# Altium schematic sheet Sheet1.SchDoc
size A4; SheetNumber: 1; SheetTotal: 1
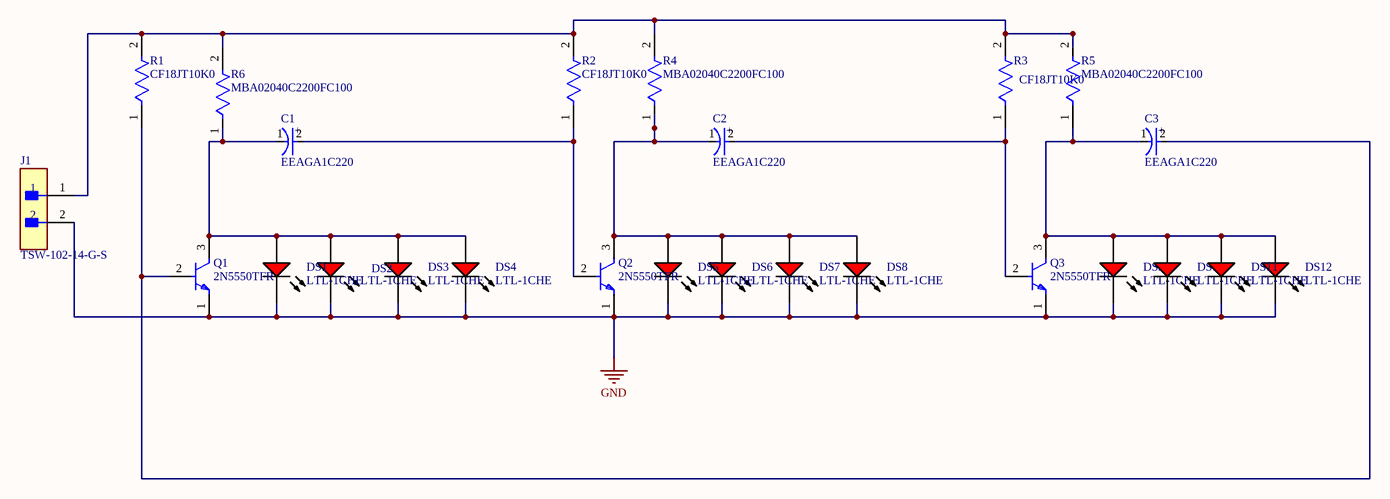
[diagram p0: Sheet1.SchDoc]

## Parts
C1  EEAGA1C220  [FP-RAD-TH-D_5_0_5-L_7_1-F-MFG]
C2  EEAGA1C220  [FP-RAD-TH-D_5_0_5-L_7_1-F-MFG]
C3  EEAGA1C220  [FP-RAD-TH-D_5_0_5-L_7_1-F-MFG]
DS1  LTL-1CHE  [INDPR60-254-520X380X650]
DS2  LTL-1CHE  [INDPR60-254-520X380X650]
DS3  LTL-1CHE  [INDPR60-254-520X380X650]
DS4  LTL-1CHE  [INDPR60-254-520X380X650]
DS5  LTL-1CHE  [INDPR60-254-520X380X650]
DS6  LTL-1CHE  [INDPR60-254-520X380X650]
DS7  LTL-1CHE  [INDPR60-254-520X380X650]
DS8  LTL-1CHE  [INDPR60-254-520X380X650]
DS9  LTL-1CHE  [INDPR60-254-520X380X650]
DS10  LTL-1CHE  [INDPR60-254-520X380X650]
DS11  LTL-1CHE  [INDPR60-254-520X380X650]
DS12  LTL-1CHE  [INDPR60-254-520X380X650]
J1  TSW-102-14-G-S  [FP-TSW-102-14-G-S-MFG]
Q1  2N5550TFR  [FP-135AR-MFG]
Q2  2N5550TFR  [FP-135AR-MFG]
Q3  2N5550TFR  [FP-135AR-MFG]
R1  CF18JT10K0  [FP-CF18-MFG]
R2  CF18JT10K0  [FP-CF18-MFG]
R3  CF18JT10K0  [FP-CF18-MFG]
R4  MBA02040C2200FC100  [FP-MBA0204-MFG]
R5  MBA02040C2200FC100  [FP-MBA0204-MFG]
R6  MBA02040C2200FC100  [FP-MBA0204-MFG]

## Nets
GND: DS1.2(K) DS2.2(K) DS3.2(K) DS4.2(K) DS5.2(K) DS6.2(K) DS7.2(K) DS8.2(K) DS9.2(K) DS10.2(K) DS11.2(K) DS12.2(K) J1.2 Q1.1(E) Q2.1(E) Q3.1(E)
NetC1_1: C1.1(C) DS1.1(A) DS2.1(A) DS3.1(A) DS4.1(A) Q1.3(C) R6.1
NetC1_2: C1.2(A) Q2.2(B) R2.1
NetC2_1: C2.1(C) DS5.1(A) DS6.1(A) DS7.1(A) DS8.1(A) Q2.3(C) R4.1
NetC2_2: C2.2(A) Q3.2(B) R3.1
NetC3_1: C3.1(C) DS9.1(A) DS10.1(A) DS11.1(A) DS12.1(A) Q3.3(C) R5.1
NetC3_2: C3.2(A) Q1.2(B) R1.1
NetJ1_1: J1.1 R1.2 R2.2 R3.2 R4.2 R5.2 R6.2

## Notes on the sheet
- (in symbol CMP-05427-000251-1) +

## Library data of the parts
C1-C3 = CMP-05427-000251-1: Aluminum Electrolytic Capacitors (Radial Lead Type) 22uF ±20% 16V; Ripple Current: 50mA; Leakage Current: 3.5uA; Polarity: Polar; Life (Hours): 1000Hour; Lead Diameter: 0.45mm; Package Quantity: 200; Termination: Radial; Series: GA; Diameter: 5mm; Lead Pitch: 2mm; Height - Seated (Max): 0.276inch; Voltage Rating (DC): 16V; Case/Package: Radial; Packaging: Bulk; Capacitance: 22uF; Mount: Through Hole; REACH SVHC: No SVHC; Radiation Hardening: No; Min Operating Temperature: -55°C; Ripple Current (AC): 50mA; Length: 7mm; Max Operating Temperature: 105°C; Construction: RADIAL; RoHS Compliant: Yes; Voltage: 16V; Voltage Rating: 16V; Height: 7mm; Tolerance: 20%
DS1-DS12 = CMP-1674-00005-1: Radial LED, 12.6 mcd, 20 mA, 2 V, -55 to 100 degC, 2-Pin THD, RoHS, Bulk; Shielding: Unshielded; Resistance: 0.045 Ohm; Current Rating: 3.6 A; Tolerance: 20%; PackageReference: LTL-1CHE; PackageDescription: 2-Pin Through Hole Device, Dia 3.8 mm, Pitch 2.54 mm; Case\Package: Radial; Length: 0.97 inch; Width: 0.62 inch; Height: 1.1 inch; Radiation Hardening: No; Lead Pitch: 11.44 mm; ComponentLink1URL: http://www.us.liteon.com/; ComponentLink1Description: Manufacturer URL; RoHSCompliant: true; Packaging: Tray; Mount: Through Hole; Min Operating Temperature: -40 degC; Max Operating Temperature: 130 degC; ComponentLink2URL: https://datasheet.ciiva.com/15117/getdatasheetpartid-187746-15117985.pdf; Package Quantity: 55; ComponentLink2Description: Datasheet; DatasheetVersion: Dec-03
J1 = CMP-02766-001740-1: CONN HEADER VERT 2POS 2.54MM; Number of Positions: 2; Max Current Rating: 7.6A; Gender: Male; Max Voltage Rating (AC): 550V; Contact Mating Length: 0.32inch; REACH SVHC: No SVHC; Width: 2.54mm; Insulation Material: PBT; Contact Shape: Square; Contact Plating: Gold; Min Operating Temperature: -55°C; Contact Material: Bronze; Color: Black; Number of Contacts: 2; Housing Material: Polyester; Orientation: Straight; Flammability Rating: UL94 V-0; Max Operating Temperature: 125°C; Contact Type: Male Pin; Radiation Hardening: No; Termination: Solder; RoHS Compliant: Yes; Lead Free: Lead Free; Fastening Type: Pull; Pitch: 2.54mm; Number of Rows: 1; Series: TSW; Insulation Color: Black; Package Quantity: 1; Connector Type: Header; Length: 5.08mm; Contact Finish - Mating: GOLD; Mount: Through Hole; Housing Color: Black; Depth: 2.54mm; Packaging: Bulk
Q1-Q3 = CMP-00278-84408887-1: 2N5550TFR Transistor, bjt, npn, 140V V(Br)Ceo, 600Ma I(C), to-92 Rohs Compliant: Yes; Manufacturer Lifecycle Status: ACTIVE; Gain Bandwidth Product: 300MHz; Max Power Dissipation: 625mW; hFE Min: 60; Emitter Base Voltage (VEBO): 6V; Max Junction Temperature (Tj): 150°C; Number of Elements: 1; Collector Emitter Saturation Voltage: 250mV; Element Configuration: Single; Collector Base Voltage (VCBO): 160V; Min Operating Temperature: -55°C; Case/Package: TO-92-3; Weight: 240mg; Max Frequency: 300MHz; NexarPartId: 84408887; Schedule B: 8541210080, 8541210080; Voltage Rating (DC): 140V; Lifecycle Status: Production; Mount: Through Hole; Polarity: NPN; Radiation Hardening: No; Power Dissipation: 625mW; Transition Frequency: 300MHz; RoHS: Compliant; Max Breakdown Voltage: 140V; Frequency: 300MHz; Length: 4.58mm; Current Rating: 600mA; Width: 3.86mm; Collector Emitter Voltage (VCEO): 140V; Max Operating Temperature: 150°C; Lead Free: Lead Free; Collector Emitter Breakdown Voltage: 140V; Height: 4.58mm; Max Collector Current: 600mA; Number of Pins: 3
R1-R3 = CMP-26528-000002-1: RES 10K OHM 1/8W 5% CF AXIAL; Manufacturer: Stackpole Electronics; Power Rating: 0.125W; Temperature Coefficient: 0-500ppm/°C; Resistance: 10kΩ; Voltage Rating: 250V; Value: 10kΩ; Temperature: -55°C to +155°C; Height: 2mm; Lead Free: Yes; Automotive: No; Device Class L2: Resistors; Package: CF18; Series: CF; ComponentLink2Description: Datasheet; Ipc Land Pattern Name: RESAD656W65L360D200; Manufacturer Part Number: CF18JT10K0; Temperature Range High: +155°C; RoHS: TRUE; Device Class L3: Through-Hole Resistors; Temperature Range Low: -55°C; Device Class L1: Passive Components; Category: Res; Octopart: https://octopart.com/cf18jt10k0-stackpole+electronics-19205642; Composition: Carbon Film; Digikey Description: RES 10K OHM 1/8W 5% CF AXIAL; ComponentLink2URL: http://www.seielect.com/Catalog/SEI-CF_CFM.pdf; Tolerance: 5%
R4-R6 = CMP-02408-000005-1: RES 220 OHM 0.4W 1% AXIAL; Manufacturer: Vishay BC Components; Automotive Grade: Grade 1; Value: 220Ω; Voltage Rating: 200V; Temperature Coefficient: 50ppm/°C; Description: 220 Ohms ±1% 0.4W Through Hole Resistor Axial Automotive AEC-Q200 Metal Film; Power Rating: 0.25W; Digikey Description: RES 220 OHM 0.4W 1% AXIAL; Height: 1.6mm; Automotive: Yes; Lead Free: Yes; Mouser Description: Thin Film Resistors - Through Hole .4watt 220ohms 1% 1/8watt body size; Temperature Range Low: -55°C; ComponentLink2Description: Datasheet; Temperature: -55°C to +125°C; Device Class L3: Through-Hole Resistors; Manufacturer Part Number: MBA02040C2200FC100; Ipc Land Pattern Name: RESAD500W65L360D160; Octopart: https://octopart.com/mba02040c2200fc100-vishay-43743094; Series: MBA/SMA 0204; RoHS: TRUE; Tolerance: 1%; Package: MBA0204; Device Class L1: Passive Components; ComponentLink2URL: http://www.vishay.com/docs/28766/mbxsma.pdf; Category: Res; Composition: Metal Film; Device Class L2: Resistors; Temperature Range High: +125°C; Resistance: 220Ω